# Altium schematic sheet SHT1x.SchDoc
size A
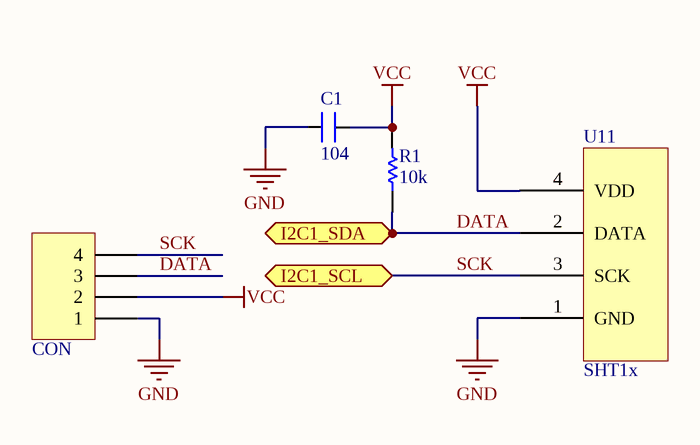
[diagram p0: SHT1x.SchDoc]

## Parts
C1  value 104  [CAPC1608N]  (hidden comment: CAP NP)
CON  Header 4H  [HDR1X4H]  (value not drawn)
R1  value 10k  [RESC2012N_F]  (hidden comment: Res)
U11  SHT1x  [SHT1x]

## Ports
I2C1_SCL, I2C1_SDA

## Nets
GND: C1.2 CON.1 U11.1(GND)
VCC: C1.1 CON.2 R1.2 U11.4(VDD)
DATA: CON.3 R1.1 U11.2(DATA) ; port I2C1_SDA
SCK: CON.4 U11.3(SCK) ; port I2C1_SCL

## Library data of the parts
CON = Header 4H: Header, 4-Pin, Right Angle; LatestRevisionDate: 17-Jul-2002; LatestRevisionNote: Re-released for DXP Platform.; Publisher: Altium Limited